# EAGLE design atariportable (EAGLE 9.4.2)
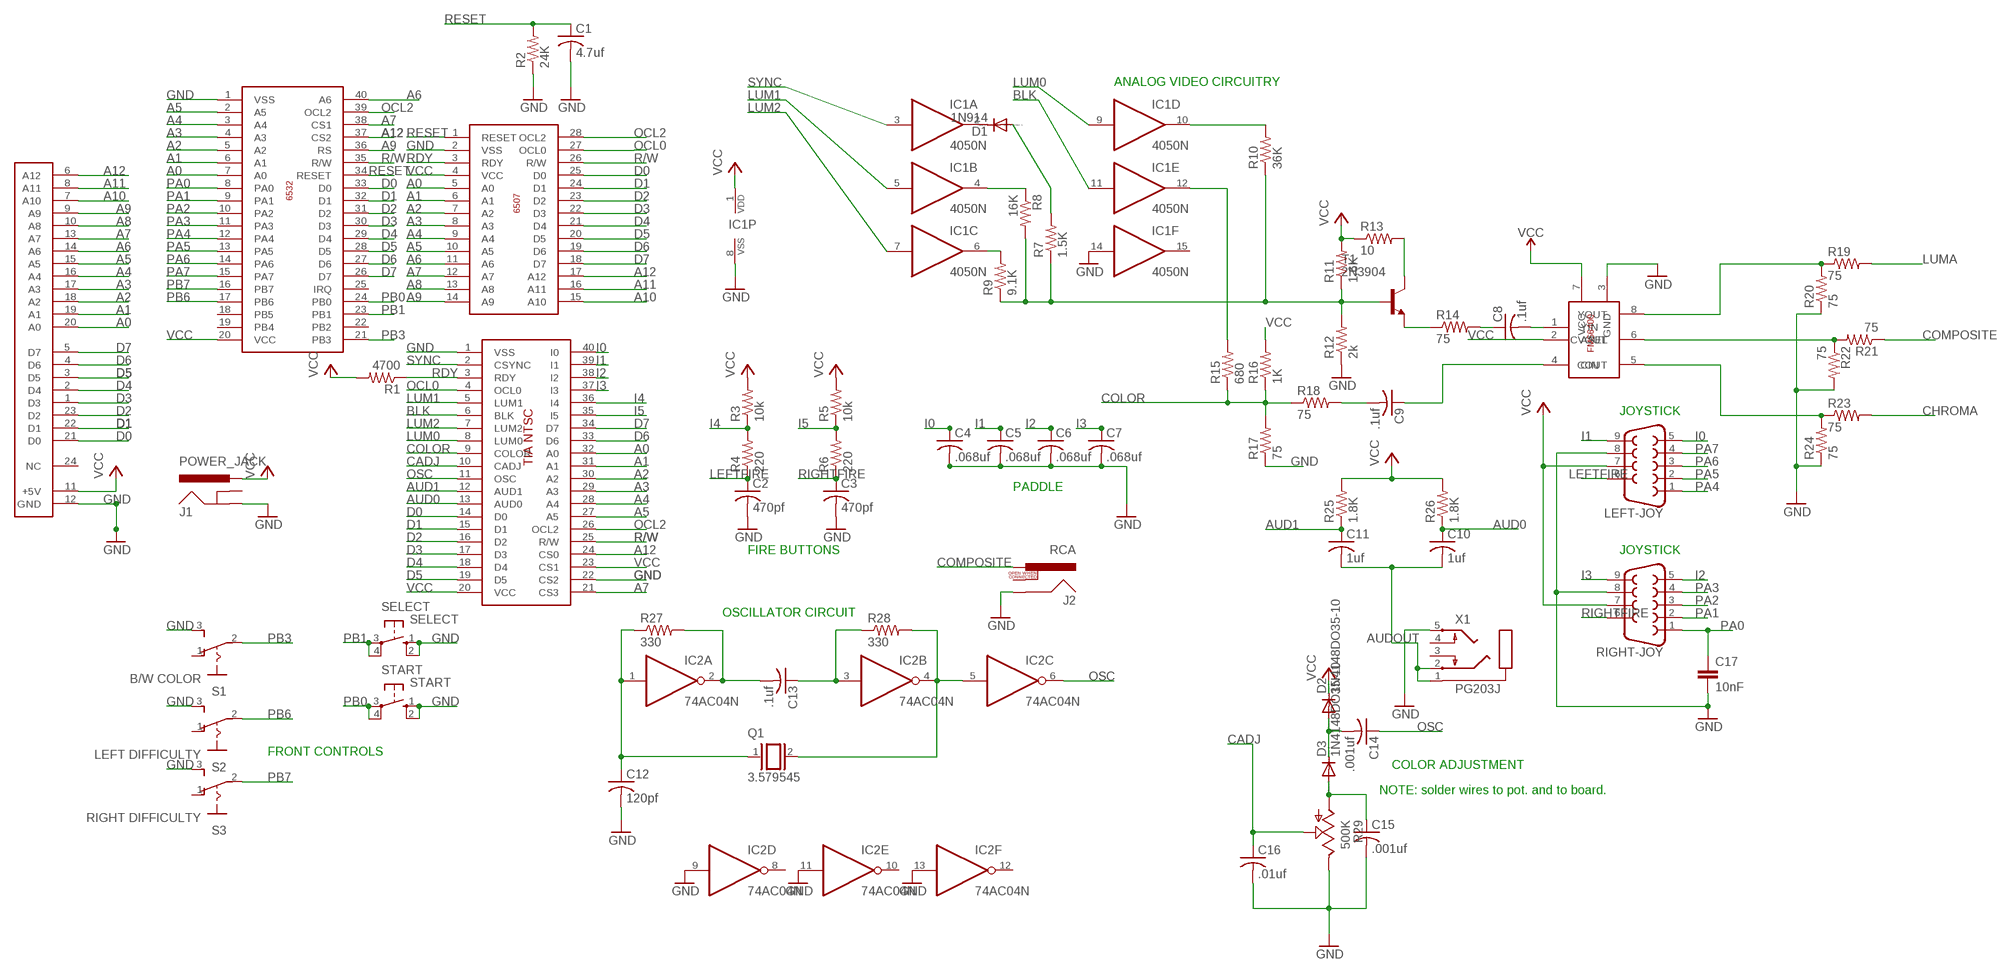
[diagram p0: schematic, sheet 1]

## Parts
6507  6507  [DIP28]
6532  6532  [DIP40]
C1  4.7uf  C-US025-030X050  [C025-030X050]
C2  470pf  C-US025-050X050  [C025-050X050]
C3  470pf  C-US025-050X050  [C025-050X050]
C4  .068uf  C-US025-024X044  [C025-024X044]
C5  .068uf  C-US025-024X044  [C025-024X044]
C6  .068uf  C-US025-024X044  [C025-024X044]
C7  .068uf  C-US025-024X044  [C025-024X044]
C8  .1uf  C-US025-025X050  [C025-025X050]
C9  .1uf  C-US025-025X050  [C025-025X050]
C10  1uf  C-US025-050X050  [C025-050X050]
C11  1uf  C-US025-050X050  [C025-050X050]
C12  120pf  C-US075-042X103  [C075-042X103]
C13  .1uf  C-US050-050X075  [C050-050X075]
C14  .001uf  C-US025-050X050  [C025-050X050]
C15  .001uf  C-US025-050X050  [C025-050X050]
C16  .01uf  C-US050-055X075  [C050-055X075]
C17  10nF  C2,5-3  [C2.5-3]
CONN1  24POSCECARDEDGE  [24POSEDGECARD]
D1  1N914  DIODE-DO35-10  [DO35-10]
D2  1N4148DO35-10  [DO35-10]
D3  1N4148DO35-10  [DO35-10]
IC1  4050N  [DIL16]
IC2  74AC04N  [DIL14]
J1  POWER_JACK  [POWER_JACK_PTH]
J2  RCA  [RCA]
LEFT-JOY  DB9MALE  [DB9_MALE]
Q1  3.579545  XTAL  [Q]
R1  4700  R-US_0207/10  [0207/10]
R2  24K  R-US_0207/10  [0207/10]
R3  10k  R-US_0207/10  [0207/10]
R4  220  R-US_0207/10  [0207/10]
R5  10k  R-US_0207/10  [0207/10]
R6  220  R-US_0207/10  [0207/10]
R7  1.5K  R-US_0207/10  [0207/10]
R8  16K  R-US_0207/10  [0207/10]
R9  9.1K  R-US_0207/10  [0207/10]
R10  36K  R-US_0207/10  [0207/10]
R11  1.6K  R-US_0207/10  [0207/10]
R12  2k  R-US_0207/10  [0207/10]
R13  10  R-US_0207/10  [0207/10]
R14  75  R-US_0207/10  [0207/10]
R15  680  R-US_0207/10  [0207/10]
R16  1K  R-US_0207/10  [0207/10]
R17  75  R-US_0207/10  [0207/10]
R18  75  R-US_0207/10  [0207/10]
R19  75  R-US_0207/10  [0207/10]
R20  75  R-US_0207/10  [0207/10]
R21  75  R-US_0207/10  [0207/10]
R22  75  R-US_0207/10  [0207/10]
R23  75  R-US_0207/10  [0207/10]
R24  75  R-US_0207/10  [0207/10]
R25  1.8K  R-US_0207/10  [0207/10]
R26  1.8K  R-US_0207/10  [0207/10]
R27  330  R-US_0207/10  [0207/10]
R28  330  R-US_0207/10  [0207/10]
R29  500K  TRIM_US-CA6V  [CA6V]
RIGHT-JOY  DB9MALE  [DB9_MALE]
S1  B/W COLOR  M251  [M251]
S2  LEFT DIFFICULTY  M251  [M251]
S3  RIGHT DIFFICULTY  M251  [M251]
SELECT  SELECT  10-XX  [B3F-10XX]
START  START  10-XX  [B3F-10XX]
T1  2N3904  [TO92]
TIA  TIA  [DIP40]
U$4  FMS6400  [SOIC8]
X1  PG203J  [PG203J]

## Nets
A0: 6507.5(A0) 6532.7(A0) CONN1.20(A0) TIA.32(A0)
A1: 6507.6(A1) 6532.6(A1) CONN1.19(A1) TIA.31(A1)
A2: 6507.7(A2) 6532.5(A2) CONN1.18(A2) TIA.30(A2)
A3: 6507.8(A3) 6532.4(A3) CONN1.17(A3) TIA.29(A3)
A4: 6507.9(A4) 6532.3(A4) CONN1.16(A4) TIA.28(A4)
A5: 6507.10(A5) 6532.2(A5) CONN1.15(A5) TIA.27(A5)
A6: 6507.11(A6) 6532.40(A6) CONN1.14(A6)
A7: 6507.12(A7) 6532.38(CS1) CONN1.13(A7) TIA.21(CS3)
A8: 6507.13(A8) CONN1.10(A8)
A9: 6507.14(A9) 6532.36(RS) CONN1.9(A9)
A10: 6507.15(A10) CONN1.7(A10)
A11: 6507.16(A11) CONN1.8(A11)
A12: 6507.17(A12) 6532.37(CS2) CONN1.6(A12) TIA.24(CS0)
AUD0: C10.1 R26.1 TIA.13(AUD0)
AUD1: C11.1 R25.1 TIA.12(AUD1)
AUDOUT: C10.2 C11.2 X1.1 X1.2
BLK: IC1.11(E:I) TIA.6(BLK)
CADJ: C16.1 R29.S TIA.10(CADJ)
CHROMA: R23.2
COLOR: R15.1 R16.1 R17.2 R18.1 TIA.9(COLOR)
COMPOSITE: J2.PIN R21.1
D0: 6507.25(D0) 6532.33(D0) CONN1.21(D0) TIA.14(D0)
D1: 6507.24(D1) 6532.32(D1) CONN1.22(D1) TIA.15(D1)
D2: 6507.23(D2) 6532.31(D2) CONN1.23(D2) TIA.16(D2)
D3: 6507.22(D3) 6532.30(D3) CONN1.1(D3) TIA.17(D3)
D4: 6507.21(D4) 6532.29(D4) CONN1.2(D4) TIA.18(D4)
D5: 6507.20(D5) 6532.28(D5) CONN1.3(D5) TIA.19(D5)
D6: 6507.19(D6) 6532.27(D6) CONN1.4(D6) TIA.33(D6)
D7: 6507.18(D7) 6532.26(D7) CONN1.5(D7) TIA.34(D7)
GND: 6507.2(VSS) 6532.1(VSS) C1.2 C2.2 C3.2 C4.2 C5.2 C6.2 C7.2 C12.2 C15.2 C16.2 C17.2 CONN1.12(GND) IC1.8(P:VSS) IC1.14(F:I) IC2.9(D:I) IC2.11(E:I) IC2.13(F:I) J1.GND J2.SHELL LEFT-JOY.8 R2.1 R12.1 R17.1 R20.1 R22.2 R24.1 R29.E RIGHT-JOY.8 S1.3(S) S2.3(S) S3.3(S) SELECT.1(S) SELECT.2(S1) START.1(S) START.2(S1) TIA.1(VSS) TIA.22(CS2) U$4.3(GND) X1.5
I0: C4.1 LEFT-JOY.5 TIA.40(I0)
I1: C5.1 LEFT-JOY.9 TIA.39(I1)
I2: C6.1 RIGHT-JOY.5 TIA.38(I2)
I3: C7.1 RIGHT-JOY.9 TIA.37(I3)
I4: R3.1 R4.2 TIA.36(I4)
I5: R5.1 R6.2 TIA.35(I5)
LEFTFIRE: C2.1 LEFT-JOY.6 R4.1
LUM0: IC1.9(D:I) TIA.8(LUM0)
LUM1: IC1.5(B:I) TIA.5(LUM1)
LUM2: IC1.7(C:I) TIA.7(LUM2)
LUMA: R19.2
N$1: D1.C IC1.2(A:O)
N$2: C8.2 U$4.1(YIN)
N$3: D1.A R7.2
N$4: IC1.4(B:O) R8.1
N$5: IC1.6(C:O) R9.2
N$6: R7.1 R8.2 R9.1 R10.1 R11.1 R12.2 T1.2(B)
N$7: IC1.10(D:O) R10.2
N$8: R13.2 T1.1(C)
N$9: R14.1 T1.3(E)
N$10: C8.1 R14.2
N$12: IC1.12(E:O) R15.2
N$13: C9.1 U$4.4(CIN)
N$14: C9.2 R18.2
N$15: R19.1 R20.2 U$4.8(YOUT)
N$16: R21.2 R22.1 U$4.6(CVOUT)
N$17: R23.1 R24.2 U$4.5(COUT)
N$18: C12.1 IC2.1(A:I) Q1.1 R27.1
N$19: C13.2 IC2.2(A:O) R27.2
N$20: C13.1 IC2.3(B:I) R28.1
N$21: IC2.4(B:O) IC2.5(C:I) Q1.2 R28.2
N$22: C14.2 D2.A D3.C
N$23: C15.1 D3.A R29.A
OCL0: 6507.27(OCL0) TIA.4(OCL0)
OCL2: 6507.28(OCL2) 6532.39(OCL2) TIA.26(OCL2)
OSC: C14.1 IC2.6(C:O) TIA.11(OSC)
PA0: 6532.8(PA0) C17.1 RIGHT-JOY.1
PA1: 6532.9(PA1) RIGHT-JOY.2
PA2: 6532.10(PA2) RIGHT-JOY.3
PA3: 6532.11(PA3) RIGHT-JOY.4
PA4: 6532.12(PA4) LEFT-JOY.1
PA5: 6532.13(PA5) LEFT-JOY.2
PA6: 6532.14(PA6) LEFT-JOY.3
PA7: 6532.15(PA7) LEFT-JOY.4
PB0: 6532.24(PB0) START.3(P) START.4(P1)
PB1: 6532.23(PB1) SELECT.3(P) SELECT.4(P1)
PB3: 6532.21(PB3) S1.2(P)
PB6: 6532.17(PB6) S2.2(P)
PB7: 6532.16(PB7) S3.2(P)
R/W: 6507.26(R/W) 6532.35(R/W) TIA.25(R/W)
RDY: 6507.3(RDY) R1.1 TIA.3(RDY)
RESET: 6507.1(RESET) 6532.34(RESET) C1.1 R2.2
RIGHTFIRE: C3.1 R6.1 RIGHT-JOY.6
SYNC: IC1.3(A:I) TIA.2(CSYNC)
VCC: 6507.4(VCC) 6532.20(VCC) CONN1.11(+5V) D2.C IC1.1(P:VDD) J1.PWR LEFT-JOY.7 R1.2 R3.2 R5.2 R11.2 R13.1 R16.2 R25.2 R26.2 RIGHT-JOY.7 TIA.20(VCC) TIA.23(CS1) U$4.2(ASEL) U$4.7(VCC)
Unconnected: 6532.18(PB5) 6532.19(PB4) 6532.22(PB2) 6532.25(IRQ) CONN1.24(NC) IC1.15(F:O) IC2.8(D:O) IC2.10(E:O) IC2.12(F:O) J1.GNDBREAK J2.SWITCH S1.1(O) S2.1(O) S3.1(O) X1.3 X1.4

## Notes on the sheet
- ANALOG VIDEO CIRCUITRY
- JOYSTICK
- PADDLE
- FIRE BUTTONS | JOYSTICK
- OSCILLATOR CIRCUIT
- FRONT CONTROLS | COLOR ADJUSTMENT
- NOTE: solder wires to pot. and to board.

## Power pins joined to a net without a drawn wire
GND: IC2.7(P:GND)
VCC: IC2.14(P:VCC)

## Library data of the parts
6507 = Atari2600-2:6507
6532 = Atari2600-2:6532
C1 C4-C9 = resistor:C-US: CAPACITOR, American symbol
C2 C3 C10-C16 = rcl:C-US: CAPACITOR, American symbol
C17 = capacitor-wima:C: CAPACITOR naming: grid - package width
CONN1 = 2600:24POSCE
D1 = diode:DIODE-: DIODE
D2 D3 = diode:1N4148: DIODE high speed (Philips)
IC1 = 40xx:4050: Hex non-inverting BUFFER
IC2 = 74xx-eu:74*04: Hex INVERTER
J1 = SparkFun-Connectors:POWER_JACK: Power Jack Connector This is the standard 5.5mm barrel jack for power. The PTH is the most common, proven, reliable, footprint. The Slot footprint only works if the mill layer is transmitted to the PCB fab house so be warned. Here are the connectors we sell at SparkFun: DC Barrel Power Jack/Connector <https://www.sparkfun.com/products/119> (PRT-00119) DC Barrel Power Jack/Connector (SMD) <https://www.sparkfun.com/products/12748> (PRT-12748) DC Barrel Jack Adapter - Breadboard Compatible <https://www.sparkfun.com/products/10811> (PRT-10811) It is used on this SparkFun product (and many, many others): SparkFun RedBoard - Programmed with Arduino <https://www.sparkfun.com/products/12757> (DEV-12757) Also, if you need a mating power supply or connector, please check these out: Wall Adapter Power Supply - 9VDC 650mA <https://www.sparkfun.com/products/298> (TOL-00298) DC Barrel Jack Adapter - Male <https://www.sparkfun.com/products/10287> (PRT-10287); PROD_ID: CONN-08197
J2 = SparkFun-Connectors:RCA: RCA Jack connector This is a right angle RCA jack connecotr. Commonly used for video or audio. Here is the connector we sell at SparkFun: RCA Jack <https://www.sparkfun.com/products/8631> (PRT-08631) Datasheet <http://www.sparkfun.com/datasheets/Prototyping/Connectors/RCA-Jack.pdf> It is not used on any active designs, however it was used on a couple retired products: RCA Jack Breakout [RETIRED] <https://www.sparkfun.com/products/8826> (PRT-08826) SparkFun On Screen Display Breakout - MAX7456 [RETIRED] <https://www.sparkfun.com/products/9168> (BOB-09168) You may also be interested in a cable: RCA Video Cable - 6' <https://www.sparkfun.com/products/11573> (CAB-11573); PROD_ID: CONN-09081; SF_ID: PRT-08631
LEFT-JOY RIGHT-JOY = SparkFun-Connectors:DB9: DB9 Connector Standard DB9 (D-Sub 9) serial connector. Can be used for CAN bus as well as RS485 and RS232. Footprint production proven. Here is the female version connector we sell at SparkFun: 9 Pin Female Serial Connector - PCB Mount <https://www.sparkfun.com/products/429> (PRT-00429) This connector has been used on the following SparkFun products: SparkFun RS232 Shifter - SMD <https://www.sparkfun.com/products/449> (PRT-00449) SparkFun RS232 Shifter SMD (No DB9) <https://www.sparkfun.com/products/8780> (PRT-08780); PROD_ID: CONN-09904
Q1 = special:XTAL: CRYSTAL
R1 R2 = resistor:R-US_: RESISTOR, American symbol
R3-R28 = rcl:R-US_: RESISTOR, American symbol
R29 = pot:TRIM_US-: POTENTIOMETER
S1-S3 = switch:M251: SLIDING SWITCH Mors, distributor Buerklin, 11G702
SELECT START = switch-omron:10-XX: OMRON SWITCH; MPN: B3F-1000; OC_FARNELL: 176432; OC_NEWARK: 36M3542
T1 = transistor:2N3904: NPN TRANSISTOR
TIA = Atari2600-2:TIA: The Television Interface Adapter used on the Atari 2600
U$4 = Atari2600-2:FMS6400
X1 = con-hirschmann:PG203J: MIC/HEADPHONE JACK KS-S stereo microphone/headphone jack PG203JN (Schukat); OC_FARNELL: unknown; OC_NEWARK: unknown

## Board
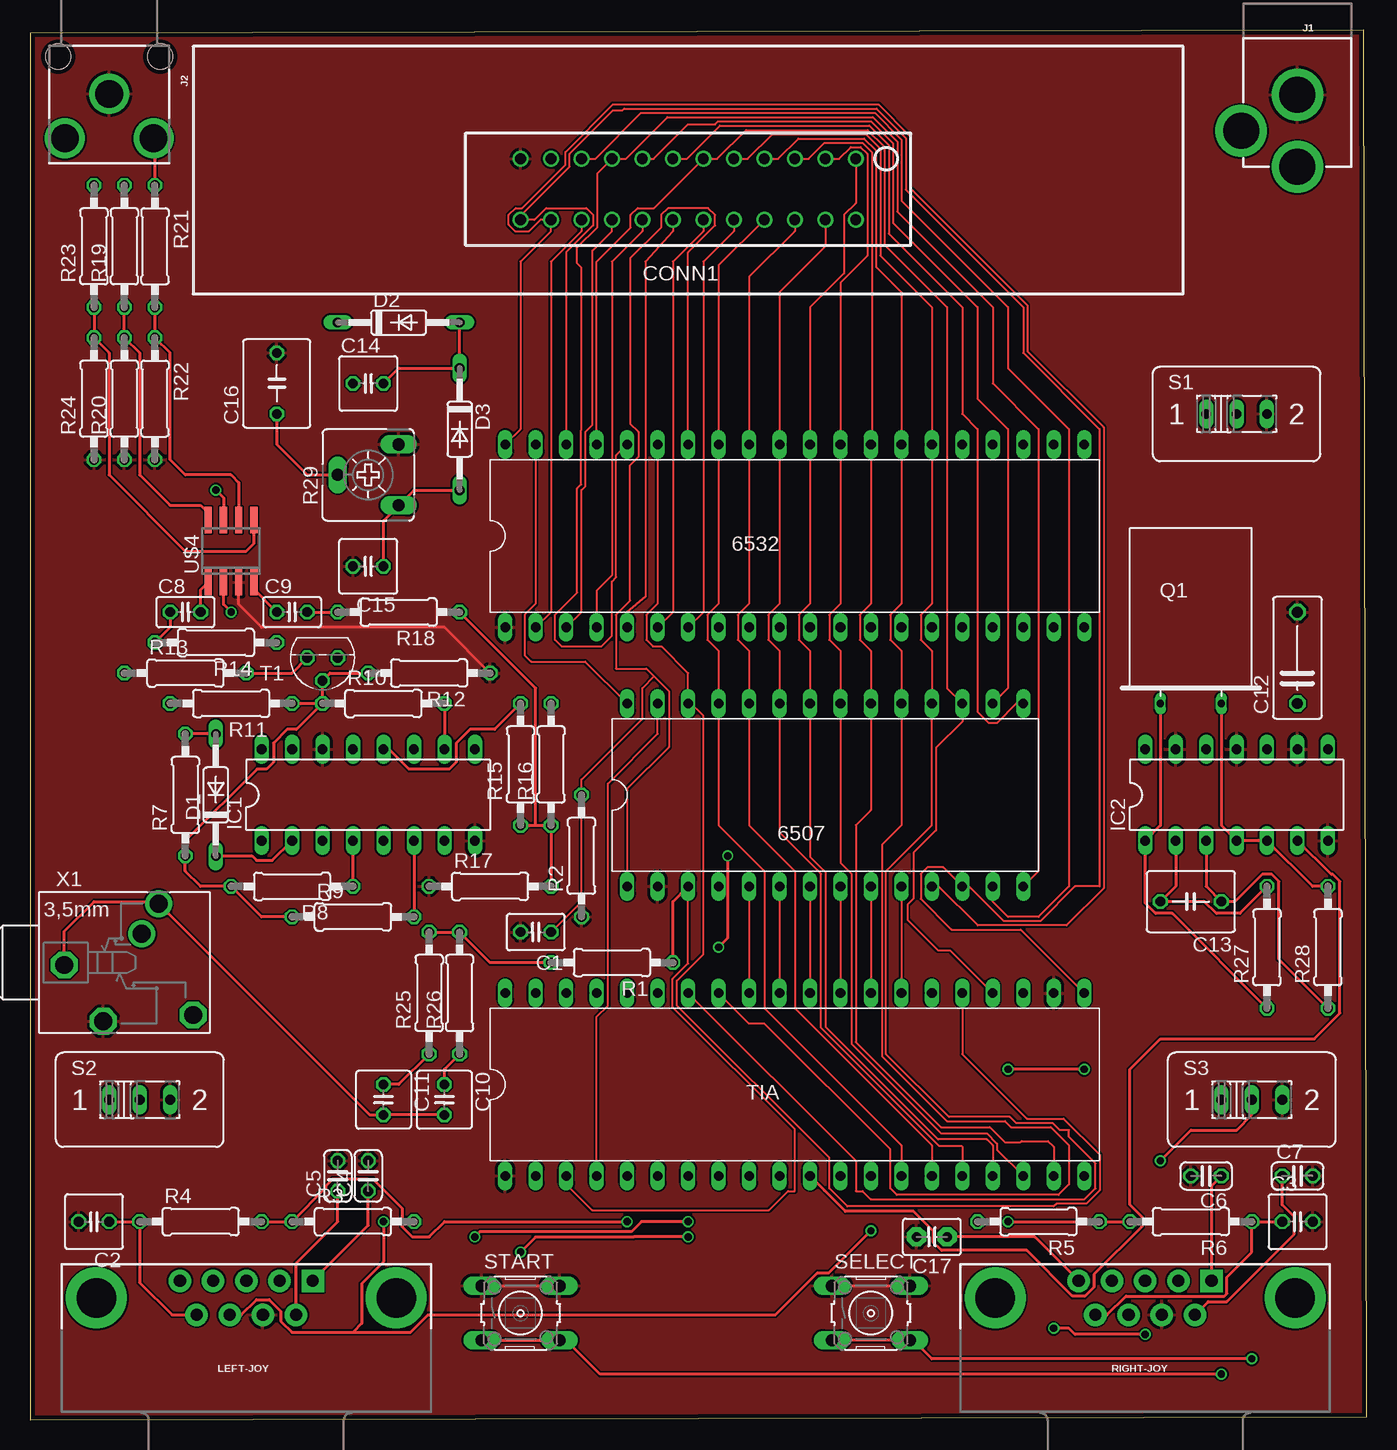
[diagram p1: board, top side]
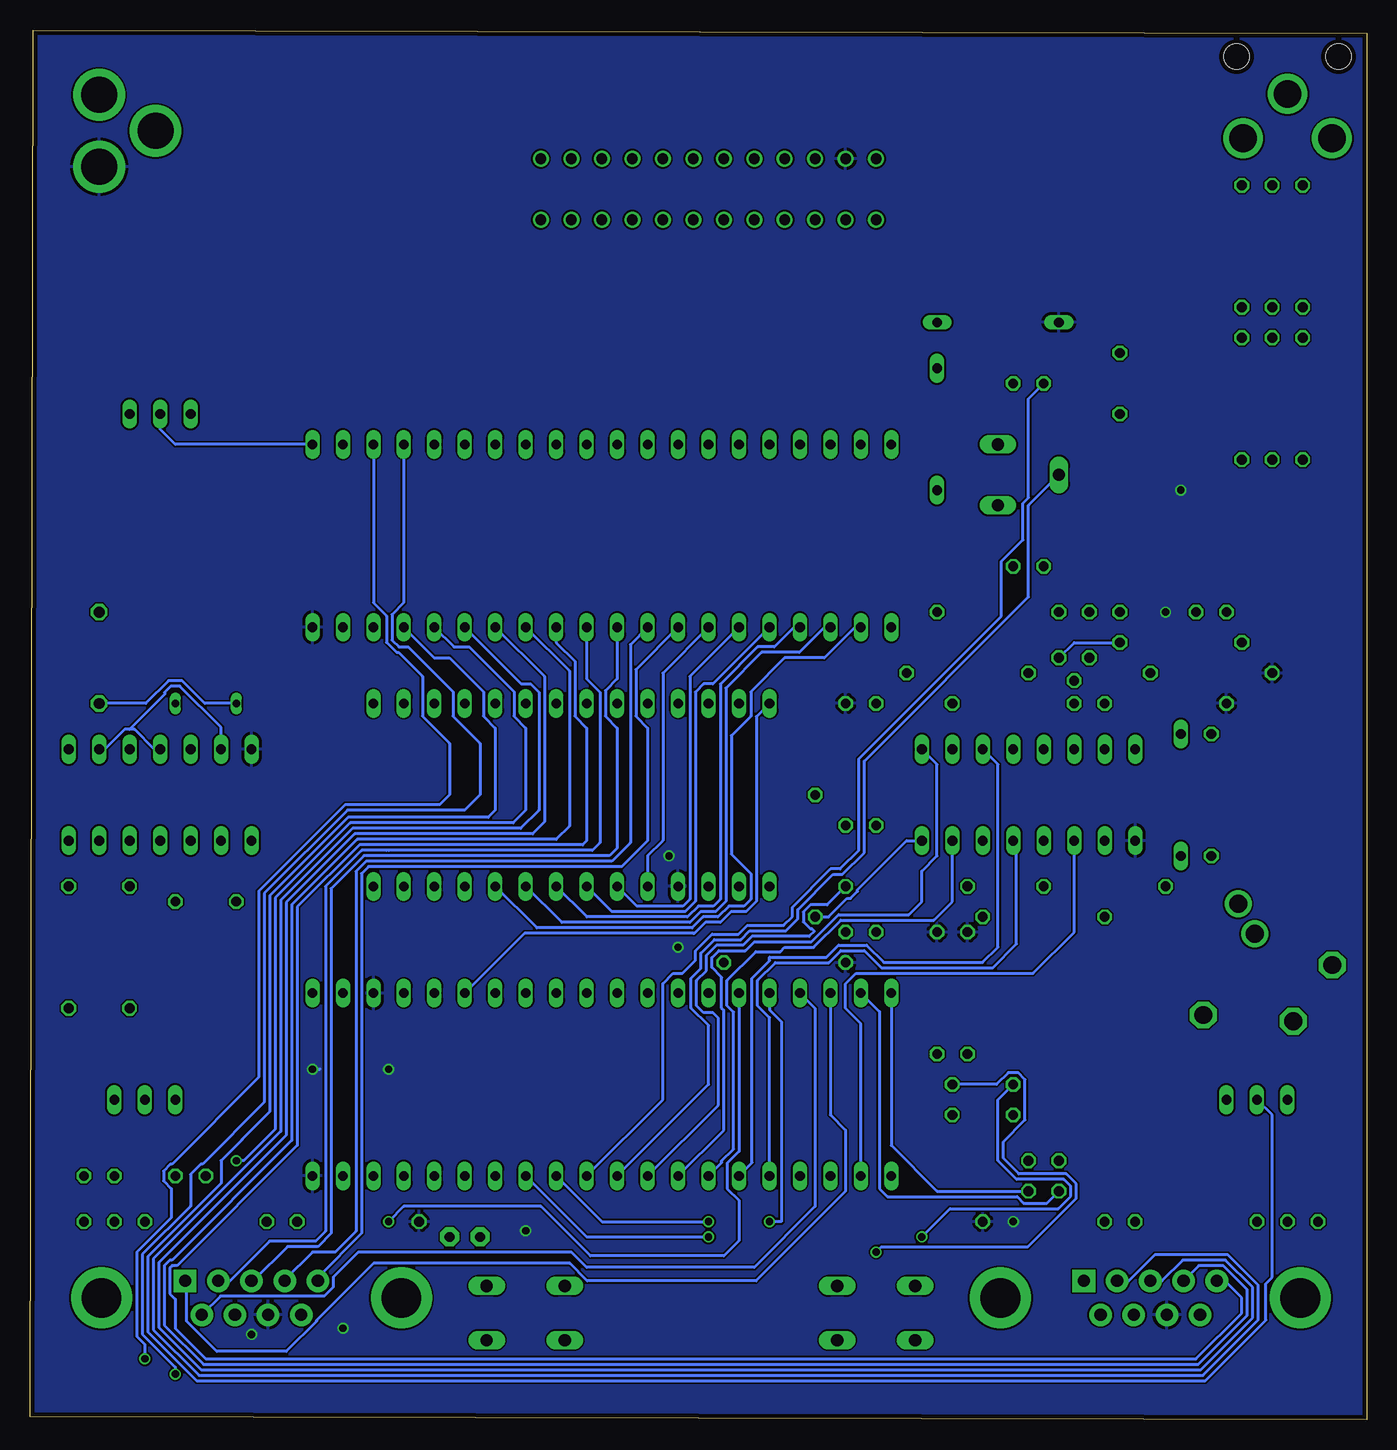
[diagram p2: board, bottom side, seen from below]

Size 111.43 x 115.81 mm. Coordinates in mm from the lower left corner, seen from the top.
Outline: 0,0 111.43,0.25 111.18,115.81 0,115.56 0,0
Copper layers (1*16): Top 0.035559375mm / dielectric 1.6mm / Bottom 0.035559375mm
Design rules "oshpark-2layer": minimum track width 6mil, minimum drill 10mil, track to track 6mil, track to pad 6mil, pad to pad 6mil, via to via 6mil, smd to smd 6mil, copper to edge 15mil, drill to drill 6mil, minimum pad ring 5mil, minimum via ring 5mil, stop-mask expansion 2.5mil, vias tented up to drill 0mil, thermal gap 10mil

### Footprints (pad centres in the part's own frame; a part is rotated, then mirrored left to right if it is on the bottom)
DIP28 = drill 0.8 long: 1 -7.62,12.7; 2 -7.62,10.16; 3 -7.62,7.62; 4 -7.62,5.08; 5 -7.62,2.54; 6 -7.62,0; 7 -7.62,-2.54; 8 -7.62,-5.08; 9 -7.62,-7.62; 10 -7.62,-10.16; 11 -7.62,-12.7; 12 -7.62,-15.24; 13 -7.62,-17.78; 14 -7.62,-20.32; 15 7.62,-20.32; 16 7.62,-17.78; 17 7.62,-15.24; 18 7.62,-12.7; 19 7.62,-10.16; 20 7.62,-7.62; 21 7.62,-5.08; 22 7.62,-2.54; 23 7.62,0; 24 7.62,2.54; 25 7.62,5.08; 26 7.62,7.62; 27 7.62,10.16; 28 7.62,12.7
DIP40 = drill 0.8 long: 1 -10.16,12.7; 2 -10.16,10.16; 3 -10.16,7.62; 4 -10.16,5.08; 5 -10.16,2.54; 6 -10.16,0; 7 -10.16,-2.54; 8 -10.16,-5.08; 9 -10.16,-7.62; 10 -10.16,-10.16; 11 -10.16,-12.7; 12 -10.16,-15.24; 13 -10.16,-17.78; 14 -10.16,-20.32; 15 -10.16,-22.86; 16 -10.16,-25.4; 17 -10.16,-27.94; 18 -10.16,-30.48; 19 -10.16,-33.02; 20 -10.16,-35.56; 21 5.08,-35.56; 22 5.08,-33.02; 23 5.08,-30.48; 24 5.08,-27.94; 25 5.08,-25.4; 26 5.08,-22.86; 27 5.08,-20.32; 28 5.08,-17.78; 29 5.08,-15.24; 30 5.08,-12.7; 31 5.08,-10.16; 32 5.08,-7.62; 33 5.08,-5.08; 34 5.08,-2.54; 35 5.08,0; 36 5.08,2.54; 37 5.08,5.08; 38 5.08,7.62; 39 5.08,10.16; 40 5.08,12.7
C025-030X050 = drill 0.813 octagon: 1 -1.27,0; 2 1.27,0
C025-050X050 = drill 0.813 octagon: 1 -1.27,0; 2 1.27,0
C025-024X044 = drill 0.813 octagon: 1 -1.27,0; 2 1.27,0
C025-025X050 = drill 0.813 octagon: 1 -1.27,0; 2 1.27,0
C075-042X103 = drill 0.914 octagon: 1 -3.81,0; 2 3.81,0
C050-050X075 = drill 0.813 octagon: 1 -2.54,0; 2 2.54,0
C050-055X075 = drill 0.813 octagon: 1 -2.54,0; 2 2.54,0
C2.5-3 = drill 0.813 pad 1.6 octagon: 1 -1.27,0; 2 1.27,0
24POSEDGECARD = drill 0.889: 1 -13.97,-0.94; 2 -11.43,-0.94; 3 -8.89,-0.94; 4 -6.35,-0.94; 5 -3.81,-0.94; 6 -1.27,-0.94; 7 1.27,-0.94; 8 3.81,-0.94; 9 6.35,-0.94; 10 8.89,-0.94; 11 11.43,-0.94; 12 13.97,-0.94; 13 13.97,4.14; 14 11.43,4.14; 15 8.89,4.14; 16 6.35,4.14; 17 3.81,4.14; 18 1.27,4.14; 19 -1.27,4.14; 20 -3.81,4.14; 21 -6.35,4.14; 22 -8.89,4.14; 23 -11.43,4.14; 24 -13.97,4.14
DO35-10 = drill 0.813 long: A 5.08,0; C -5.08,0
DIL16 = drill 0.813 long: 1 -8.89,-3.81; 2 -6.35,-3.81; 3 -3.81,-3.81; 4 -1.27,-3.81; 5 1.27,-3.81; 6 3.81,-3.81; 7 6.35,-3.81; 8 8.89,-3.81; 9 8.89,3.81; 10 6.35,3.81; 11 3.81,3.81; 12 1.27,3.81; 13 -1.27,3.81; 14 -3.81,3.81; 15 -6.35,3.81; 16 -8.89,3.81
DIL14 = drill 0.813 long: 1 -7.62,-3.81; 2 -5.08,-3.81; 3 -2.54,-3.81; 4 0,-3.81; 5 2.54,-3.81; 6 5.08,-3.81; 7 7.62,-3.81; 8 7.62,3.81; 9 5.08,3.81; 10 2.54,3.81; 11 0,3.81; 12 -2.54,3.81; 13 -5.08,3.81; 14 -7.62,3.81
POWER_JACK_PTH = drill 2.997 pad 4.318: GND 0,7.7; GNDBREAK 4.7,10.7; PWR 0,13.7
RCA = drill 2.3: PIN 3.7,3.7; SHELL 0,0; SWITCH 3.7,-3.7 | hole 2.1: -3.1,4.25; -3.1,-4.25
DB9_MALE = drill 1.016 pad 1.88: 1 5.54,-1.42; 2 2.77,-1.42; 3 0,-1.42; 4 -2.77,-1.42; 6 4.15,1.42; 7 1.38,1.42; 8 -1.38,1.42; 9 -4.15,1.42 | drill 1.016 pad 1.88 square: 5 -5.54,-1.42 | drill 3.302 pad 5.08: G1 -12.5,0; G2 12.5,0
Q = drill 0.61 long: 1 -2.54,-7.62; 2 2.54,-7.62
0207/10 = drill 0.813 octagon: 1 -5.08,0; 2 5.08,0
CA6V = drill 1.016 long: A -2.54,-2.54; E 2.54,-2.54; S 0,2.54
M251 = drill 0.813 long: 1 -2.54,0; 2 0,0; 3 2.54,0
B3F-10XX = drill 1.016 long: 1 -3.251,2.261; 2 3.251,2.261; 3 -3.251,-2.261; 4 3.251,-2.261
TO92 = drill 0.813 octagon: 1 1.27,0; 2 0,1.905; 3 -1.27,0
SOIC8 = smd 0.6 x 2.2: 1 -1.905,-2.6; 2 -0.635,-2.6; 3 0.635,-2.6; 4 1.905,-2.6; 5 1.905,2.6; 6 0.635,2.6; 7 -0.635,2.6; 8 -1.905,2.6
PG203J = drill 1.499 octagon: 1 -5.004,-0.203; 4 5.74,-4.369; 5 -1.753,-4.902 | drill 1.499: 2 2.845,4.902; 3 1.448,2.388

### Placement (x,y rotation side)
6507  62.48,52.07 90 top
6532  52.32,76.2 90 top
C1  42.16,40.64 180 top
C2  5.33,16.51 180 top
C3  105.66,16.51 0 top
C4  28.19,20.32 90 top
C5  25.65,20.32 90 top
C6  98.04,20.32 180 top
C7  105.66,20.32 0 top
C8  12.95,67.31 0 top
C9  21.84,67.31 0 top
C10  34.54,26.67 270 top
C11  29.46,26.67 270 top
C12  105.66,63.5 90 top
C13  96.77,43.18 180 top
C14  28.19,86.36 0 top
C15  28.19,71.12 180 top
C16  20.57,86.36 90 top
C17  75.18,15.24 180 top
CONN1  54.86,104.14 180 top
D1  15.49,52.07 90 top
D2  30.73,91.44 0 top
D3  35.81,82.55 270 top
IC1  28.19,52.07 0 top
IC2  100.58,52.07 0 top
J1  105.66,118.11 180 top
J2  6.6,110.49 270 top
LEFT-JOY  18.03,10.16 180 top
Q1  96.77,67.31 0 top
R1  48.51,38.1 180 top
R2  45.97,46.99 90 top
R3  26.92,16.51 0 top
R4  14.22,16.51 0 top
R5  84.07,16.51 180 top
R6  96.77,16.51 180 top
R7  12.95,52.07 90 top
R8  21.84,44.45 180 top
R9  26.92,41.91 0 top
R10  29.46,59.69 0 top
R11  16.76,59.69 180 top
R12  33.27,62.23 180 top
R13  12.95,62.23 0 top
R14  15.49,64.77 180 top
R15  40.89,54.61 90 top
R16  43.43,54.61 90 top
R17  38.35,44.45 0 top
R18  30.73,67.31 180 top
R19  7.87,97.79 90 top
R20  7.87,85.09 90 top
R21  10.41,97.79 270 top
R22  10.41,85.09 270 top
R23  5.33,97.79 90 top
R24  5.33,85.09 90 top
R25  33.27,35.56 90 top
R26  35.81,35.56 90 top
R27  103.12,39.37 90 top
R28  108.2,39.37 90 top
R29  28.19,78.74 90 top
RIGHT-JOY  92.96,10.16 180 top
S1  100.58,83.82 0 top
S2  9.14,26.67 0 top
S3  101.85,26.67 0 top
SELECT  70.1,8.89 0 top
START  40.89,8.89 0 top
T1  24.38,63.5 180 top
TIA  52.32,30.48 90 top
U$4  16.76,72.39 0 top
X1  7.87,38.1 0 top

### Tracks (layer width: path | path; a pad name or v marks a point on that pad's centre or on a via)
A0
  Top 0.152: CONN1.20 58.67,99.06 56.13,96.52 56.13,67.31 6532.7 | 6507.5 TIA.32
  Bottom 0.254: 6532.7 58.67,62.23 58.67,48.26 59.94,46.99 6507.5
A1
  Top 0.152: CONN1.19 56.13,99.06 53.59,96.52 53.59,67.31 6532.6 | 6507.6 TIA.31
  Bottom 0.254: 6532.6 56.42,61.94 56.42,43.39 57,42.81 60.85,42.81 6507.6
A2
  Top 0.152: CONN1.18 53.59,99.06 51.31,96.52 51.31,68.58 49.78,67.31 6532.5 | 6507.7 TIA.30
  Bottom 0.254: 6532.5 54.5,61.33 55.27,61.33 55.96,60.64 55.96,43.2 56.81,42.35 62.93,42.35 6507.7
A3
  Top 0.152: CONN1.17 51.05,99.06 48.51,96.52 48.51,70.36 47.24,69.09 6532.4 | 6507.8 TIA.29
  Bottom 0.254: 6532.4 47.74,66.04 49.38,64.4 50.78,64.4 53.88,61.3 53.88,43.39 54.46,42.81 55.7,42.81 56.62,41.9 65.01,41.9 6507.8
A4
  Top 0.152: CONN1.16 48.51,99.06 46.89,97.43 46.89,82.9 46.31,82.32 46.31,77.81 45.97,77.47 45.97,67.31 6532.3 | 6507.9 TIA.28
  Bottom 0.254: 6532.3 45.2,66.04 47.29,63.95 50.44,63.95 53.42,60.96 53.42,43.2 54.27,42.35 55.51,42.35 56.43,41.44 67.09,41.44 6507.9
A5
  Top 0.152: CONN1.15 45.97,99.06 43.43,96.52 43.43,67.31 6532.2 | 6507.10 TIA.27
  Bottom 0.254: 6532.2 42.66,66.04 45.21,63.49 48.51,63.49 51.34,60.66 51.34,58.63 52.96,57 52.96,47.14 51.34,45.51 51.34,43.39 51.92,42.81 53.16,42.81 54.08,41.9 55.32,41.9 56.24,40.98 69.18,40.98 6507.10
A6
  Top 0.152: 6532.40 40.89,82.55 40.89,96.52 43.43,99.06 CONN1.14 42.55,100 41.58,99.02 40.49,99.02 39.92,99.59 39.92,100.41 40.49,100.98 41.04,100.98 44.64,104.58 44.64,105.63 48.62,109.61 70.71,109.61 73.37,106.96 73.37,102.65 83.16,92.86 83.16,89.05 89.51,82.7 89.51,44.3 86.41,41.2 79,41.2 75.75,44.45 6507.11
A7
  Top 0.152: 6532.38 44.7,97.29 46.95,99.53 46.95,100.41 46.38,100.98 43.03,100.98 42.05,100 CONN1.13 40.89,100.33 45,104.43 45,105.48 48.62,109.11 49.39,109.11 49.54,109.26 70.56,109.26 73.01,106.81 73.01,102.5 82.8,92.71 82.8,88.9 89.15,82.55 89.15,44.45 87.12,44.45 84.22,41.55 81.19,41.55 78.29,44.45 6507.12 76.14,46.04 74.8,46.04 74.25,45.49 74.25,43.41 76.82,40.84 82.6,40.84 TIA.21
A8
  Top 0.152: CONN1.10 47.13,105.08 50.95,108.9 70.42,108.9 72.66,106.66 72.66,101.59 81.53,92.71 81.53,87.63 86.61,82.55 86.61,44.45 84.07,41.91 81.53,41.91 80.26,43.18 6507.13
A9
  Top 0.152: 6507.14 84.07,45.72 84.07,82.55 80.26,86.36 80.26,92.71 72.3,100.67 72.3,106.52 70.27,108.55 53.14,108.55 49.67,105.08 CONN1.9 47.31,103.87 47.31,99.39 45.62,97.7 45.62,96.37 45.97,96.02 45.97,82.49 45.95,82.47 45.95,77.95 45.62,77.62 45.62,68.93 43.77,67.08 43.77,65 44.32,64.45 47.63,64.45 48.51,65.34 48.51,69.86 48.87,70.21 48.87,80.37 6532.36
A10
  Top 0.152: CONN1.7 54.75,105.08 57.51,107.84 69.98,107.84 71.59,106.22 71.59,98.84 77.72,92.71 77.72,83.82 78.99,82.55 78.99,58.99 79.88,58.1 80.65,58.1 82.24,59.69 6507.15
A11
  Top 0.152: CONN1.8 51.99,105.08 54.86,107.95 57.12,107.95 57.36,108.19 70.12,108.19 71.94,106.37 71.94,99.76 78.99,92.71 78.99,85.09 81.53,82.55 81.53,60.96 6507.16
A12
  Top 0.152: 6532.37 47.24,96.52 50.08,99.35 50.08,100.41 50.65,100.98 52.03,100.98 CONN1.6 57.29,105.08 59.69,107.48 69.83,107.48 71.23,106.07 71.23,97.93 76.45,92.71 76.45,60.96 6507.17 77.72,58.17 75.54,55.98 75.54,49.12 73.66,47.24 73.66,43.43 73.15,42.93 73.15,41.66 75.69,39.12 76.71,39.12 TIA.24
AUD0  (via drill 0.61)
  Top 0.254: C10.1 34.54,29.21 R26.1 | v54.86,15.24 50.35,15.24 50.32,15.21 42.14,15.21 v40.89,13.97
  Bottom 0.254: TIA.13 65.02,15.24 v54.86,15.24 | v40.89,13.97 40.46,14.4 28.25,14.4 24.21,18.45 24.21,19.65 25.05,20.5 29,20.5 30.28,21.78 30.28,23.19 28.47,24.99 28.47,28.35 29.05,28.93 29.87,28.93 30.87,27.94 C10.1
AUD1  (via drill 0.61)
  Top 0.254: R25.1 30.73,27.94 C11.1 | v54.86,16.51 50.97,16.51 50.13,15.67 37.52,15.67 v37.08,15.24
  Bottom 0.254: TIA.12 63.75,16.51 v54.86,16.51 | v37.08,15.24 34.72,17.6 25.7,17.6 24.66,18.64 24.66,19.46 25.24,20.04 29.18,20.04 30.73,21.59 30.73,26.67 C11.1
AUDOUT
  Top 0.254: C10.2 C11.2 28.32,25.4 X1.2 10.54,43.18 5.33,43.18 2.87,40.72 X1.1
BLK
  Bottom 0.254: IC1.11 30.73,54.61 30.73,39.39 32.02,38.11 40.26,38.11 41.7,39.55 44.03,39.55 45.02,38.56 49.78,38.56 49.78,38.25 51.22,36.81 51.22,21.42 TIA.6
CADJ
  Top 0.254: C16.1 20.57,81.28 23.11,78.74 R29.S
  Bottom 0.254: TIA.10 54.86,27.94 54.86,32.87 56.3,34.31 56.3,36.81 55.5,37.62 55.5,38.89 54.38,40 52.17,40 51.43,40.74 48.41,40.74 47.42,41.73 47.42,42.51 44.49,45.44 43.71,45.44 41.88,47.27 41.88,54.89 28.19,68.58 28.19,76.2 R29.S
COLOR
  Top 0.254: R15.1 42.16,49.53 | 42.16,49.53 R16.1 R17.2 | 42.16,49.53 42.16,60.96 R18.1
  Bottom 0.254: TIA.9 54.05,26.21 54.05,33.48 54.5,33.92 55.27,33.92 55.85,34.5 55.85,36.62 55.04,37.43 55.04,38.7 54.19,39.55 51.98,39.55 51.24,40.28 46.48,40.28 46.05,40.72 46.25,40.92 46.38,40.92 46.96,41.5 46.96,42.32 46.38,42.9 44.98,42.9 R17.2
COMPOSITE
  Top 0.254: J2.PIN 10.41,106.68 R21.1
D0
  Top 0.152: CONN1.21 57.4,96.19 6532.33 57.4,68.01 56.47,67.08 56.47,65 57.4,64.07 6507.25 57.4,49.53 61.21,45.72 61.21,34.29 72.64,22.86 TIA.14
D1
  Top 0.152: CONN1.22 63.75,99.06 59.94,95.25 6532.32 59.94,68.01 59.01,67.08 59.01,65 59.94,64.07 6507.24 59.94,49.53 61.21,48.26 63.75,45.72 63.75,34.29 75.18,22.86 TIA.15
D2
  Top 0.152: CONN1.23 66.29,97.79 62.48,93.98 6532.31 62.48,68.01 61.55,67.08 61.55,65 62.48,64.07 6507.23 62.48,48.96 65.96,45.49 65.96,32.66 75.81,22.81 77.67,22.81 77.72,22.76 TIA.16
D3
  Top 0.152: CONN1.1 68.83,101.38 67.86,100.41 67.86,95.54 65.02,92.71 6532.30 65.02,68.01 64.09,67.08 64.09,65 65.02,64.07 6507.22 65.02,46.93 66.31,45.64 66.31,32.75 75.69,23.37 79.76,23.37 80.26,22.86 TIA.17
D4
  Top 0.152: CONN1.2 67.45,105.08 68.43,106.06 69.24,106.06 69.81,105.48 69.81,97 67.56,94.75 6532.29 67.56,68.01 66.63,67.08 66.63,65 67.56,64.07 6507.21 67.56,46.42 68.5,45.49 68.5,31.33 75.95,23.88 79.75,23.88 80.62,23.01 80.62,22.5 TIA.18
D5
  Top 0.152: CONN1.3 64.91,105.08 66.25,106.41 69.39,106.41 70.17,105.63 70.17,81.34 6532.28 70.1,68.01 69.17,67.08 69.17,65 70.1,64.07 6507.20 70.1,50.8 68.85,49.55 68.85,31.48 75.95,24.38 80.01,24.38 81.28,23.11 82.55,23.11 82.66,23.22 84.86,23.22 85.34,22.74 TIA.19
D6
  Top 0.152: CONN1.4 62.37,105.08 64.06,106.77 69.53,106.77 70.52,105.78 70.52,96.1 72.64,93.98 6532.27 72.64,68.01 71.71,67.08 71.71,65 72.64,64.07 6507.19 72.64,49.53 71.04,47.92 71.04,30.31 76.45,24.89 81.27,24.89 81.78,24.38 85.09,24.38 86.61,22.86 86.61,19.62 85.73,18.73 72.26,18.73 71.71,19.28 71.71,21.46 | 71.71,21.46 | 71.71,21.46 71.71,22.52 61.21,33.02 59.94,33.02 TIA.33
D7
  Top 0.152: CONN1.5 59.83,105.08 61.88,107.12 69.68,107.12 70.88,105.93 70.88,97.02 75.18,92.71 6532.26 75.18,68.01 74.25,67.08 74.25,65 75.18,64.07 6507.18 75.18,49.53 71.39,45.74 71.37,45.72 71.37,30.48 76.61,25.25 81.69,25.25 82.2,24.74 85.24,24.74 85.85,24.13 86.61,24.13 86.61,23.56 88.82,21.36 88.82,19.28 87.91,18.38 70.07,18.38 69.4,19.05 68.83,19.05 68.83,21.59 TIA.34
GND
  Top 0.254: R12.1 34.54,66.04 19.3,66.04 17.4,67.95 U$4.3 | START.1 START.2 | SELECT.1 SELECT.2
  Bottom 0.254: R2.1 44.86,41.91 43.31,43.46 43.02,43.46 42.44,44.04 42.44,44.17 38.35,48.26 IC1.8 | 103.12,57.53 102.71,57.53 101.06,55.88 IC2.11 | 103.12,57.53 103.53,57.53 105.19,55.88 IC2.9 | IC2.13 95.5,57.7 98.95,61.14 99.68,61.14 100.2,60.62 100.2,60.45 103.12,57.53
  pour Top: 112.01,0 -2.29,0 -3.56,-1.27 -3.56,118.11 -4.83,119.38 117.09,119.38 118.36,118.11 118.36,6.35
I0
  Top 0.254: LEFT-JOY.5 28.19,16.2 C4.1
  Bottom 0.254: TIA.40 39.62,22.86 35.81,19.05 C4.1
I1
  Top 0.254: LEFT-JOY.9 22.18,13.04 25.65,16.51 C5.1
  Bottom 0.254: TIA.39 40.61,34 40.61,19.26 39.94,18.59 29.14,18.59 28.6,18.06 26.64,18.06 C5.1
I2
  Top 0.254: RIGHT-JOY.5 98.5,19.51 C6.1
  Bottom 0.254: TIA.38 44.7,25.4 43.43,24.13 43.43,19.05 50.9,11.58 64.98,11.58 66.43,13.03 82.8,13.03 87.54,8.29 87.54,8.21 90.07,5.69 95.86,5.69 98.38,8.21 98.38,11.46 RIGHT-JOY.5
I3
  Top 0.254: RIGHT-JOY.9 98.23,9.85 99.77,9.85 105.38,15.47 105.38,16.92 104.39,17.91 C7.1
  Bottom 0.254: TIA.37 45.97,34.29 45.97,17.78 51.05,12.7 65.02,12.7 66.29,13.97 84.07,13.97 86.15,11.89 86.15,11.05 86.9,10.31 95.54,10.31 RIGHT-JOY.9
I4  (via drill 0.61)
  Top 0.254: R4.2 R3.1 24.66,19.33 24.66,19.46 25.24,20.04 28.19,20.04 28.6,20.04 31.01,17.63 31.01,16.1 31.87,15.24 33.27,15.24 34.54,16.51 v49.78,16.51
  Bottom 0.254: TIA.36 49.78,34.16 48.8,33.18 48.8,16.51 v49.78,16.51
I5  (via drill 0.61)
  Top 0.254: R6.2 R5.1 v81.53,16.51
  Bottom 0.254: v81.53,16.51 80.26,17.78 68.83,17.78 64.71,13.66 53.59,13.66 52.32,14.93 52.32,18.27 53.31,19.26 53.31,21.38 52.32,22.37 TIA.35
LEFTFIRE
  Top 0.254: C2.1 R4.1 9.14,11.43 11.83,8.74 LEFT-JOY.6
LUM0
  Bottom 0.254: IC1.9 35.81,54.61 35.81,46.99 37.08,45.72 37.08,43.18 38.18,42.09 44.03,42.09 46.29,39.83 51.05,39.83 51.79,39.09 54,39.09 54.58,38.51 54.58,37.69 53.76,36.87 53.76,34.31 53.59,34.14 53.59,24.13 TIA.8
LUM1
  Bottom 0.254: IC1.5 29.18,47.98 29.18,39.65 31.18,37.66 40.45,37.66 41.88,39.09 43.84,39.09 44.83,38.1 49.29,38.1 50.77,36.62 50.77,34.5 49.78,33.51 TIA.5
LUM2
  Bottom 0.254: IC1.7 34.54,43.18 36.09,41.63 43.84,41.63 46.1,39.37 48.51,39.37 48.87,39.01 50.91,39.01 53.31,36.62 53.31,34.5 52.78,33.97 52.78,22.55 53.76,21.57 53.76,21.42 TIA.7
N$1
  Top 0.254: D1.C 18.51,46.99 18.89,46.61 20.19,46.61 IC1.2
N$2
  Top 0.254: C8.2 14.22,69.16 U$4.1
N$3
  Top 0.254: D1.A R7.2
N$4
  Top 0.254: R8.1 IC1.4
N$5
  Top 0.254: IC1.6 R9.2
N$6
  Top 0.254: R9.1 19.3,41.91 R8.2 14.22,44.45 12.95,45.72 R7.1 12.95,48.26 18.92,54.23 19.71,54.23 20.3,54.81 20.3,56.39 21.43,57.53 22.23,57.53 R10.1 | R11.1 R10.1 | R10.1 T1.2 25.02,62.23 R12.2
N$7
  Top 0.254: R10.2 IC1.10
N$8
  Top 0.254: R13.2 21.84,62.23 T1.1
N$9
  Bottom 0.254: T1.3 24.38,64.77 R14.1
N$10
  Top 0.254: C8.1 11.68,66.04 R14.2
N$12
  Top 0.254: R15.2 38.73,57.53 36.67,57.53 35.53,56.39 35.53,54.81 34.95,54.23 31.59,54.23 29.94,55.88 IC1.12
N$13
  Top 0.254: C9.1 18.67,69.22 U$4.4
N$14
  Top 0.254: C9.2 R18.2
N$15
  Top 0.254: R19.1 R20.2 9.14,88.9 9.14,78.74 11.68,76.2 14.22,76.2 14.86,75.56 U$4.8
N$16
  Top 0.254: R21.2 R22.1 11.68,88.9 11.68,80.01 12.95,78.74 16.76,78.74 17.4,78.11 U$4.6
N$17
  Top 0.254: R23.1 R24.2 6.6,88.9 6.6,78.74 12.95,72.39 18.03,72.39 18.67,73.02 U$4.5
N$18
  Top 0.254: R27.1 95.22,42.19 93.82,42.19 92.96,43.05 IC2.1 94.23,49.53 Q1.1
  Bottom 0.254: Q1.1 96.85,59.69 98.76,61.59 99.87,61.59 101.78,59.69 C12.1
N$19
  Top 0.254: IC2.2 95.5,44.45 C13.2 97.91,43.18 98.9,42.19 100.86,42.19 R27.2
N$20
  Top 0.254: IC2.3 98.04,44.45 C13.1 100.45,43.18 102.71,45.44 103.53,45.44 104.11,44.86 104.11,38.38 R28.1
N$21
  Top 0.254: R28.2 106.93,44.45 IC2.5 IC2.4 99.31,49.53 Q1.2
N$22
  Top 0.254: D2.A D3.C 30.73,87.63 C14.2
N$23
  Top 0.254: C15.1 29.46,74.93 R29.A 32,77.47 D3.A
OCL0
  Top 0.152: TIA.4 47.24,33.59 48.18,34.52 48.18,53 52.32,57.15 6507.27
OCL2
  Top 0.152: 6507.28 46.29,63.18 41.78,63.18 41.23,63.73 41.23,67.08 42.16,68.01 6532.39
  Bottom 0.254: 6507.28 50.88,58.59 50.88,43.2 51.73,42.35 52.32,42.35 52.97,42.35 53.89,41.44 55.13,41.44 56.05,40.53 56.07,40.53 56.13,40.53 70.22,40.53 TIA.26
OSC
  Top 0.254: TIA.11 66.22,19.12 66.22,19.11 67.96,17.37 73.66,17.37 75.32,15.71 75.32,14.77 75.99,14.11 83.1,14.11 86.9,10.31 87.95,10.31 88.69,11.05 88.69,12.11 92.69,16.1 92.69,16.92 91.69,17.91 91.69,29.21 94.23,31.75 107.06,31.75 109.19,33.88 109.19,44.86 108.61,45.44 108.48,45.44 IC2.6
  Bottom 0.254: TIA.11 58.67,26.67 58.67,36.34 57.81,37.2 57.04,37.2 55.96,38.28 55.96,39.08 54.57,40.46 52.36,40.46 51.62,41.2 48.6,41.2 47.88,41.92 47.88,42.7 44.68,45.9 43.9,45.9 42.34,47.46 42.34,55.08 30.46,66.97 30.46,71.53 28.65,73.33 28.65,76.39 28.19,76.85 28.19,85.09 C14.1
PA0
  Top 0.254: RIGHT-JOY.1 83.76,15.24 C17.1
  Bottom 0.254: 6532.8 60.93,62.52 60.93,58.63 59.94,57.64 59.94,48.26 62.12,46.09 83.21,46.09 83.79,45.51 83.79,15.53 87.42,11.89 RIGHT-JOY.1
PA1
  Bottom 0.254: 6532.9 61.38,64.6 61.38,48.09 62.93,46.55 83.4,46.55 84.24,45.7 84.24,15.71 85.99,13.97 87.88,13.97 90.19,11.66 RIGHT-JOY.2
PA2
  Bottom 0.254: 6532.10 62.48,61.74 63.47,60.75 63.47,58.63 62.48,57.64 62.48,47.64 63.12,47 83.59,47 86.33,44.27 86.33,15.53 87.43,14.43 89.97,14.43 92.81,11.58 RIGHT-JOY.3
PA3
  Bottom 0.254: 6532.11 65.02,61.74 63.92,60.64 63.92,48.09 64.55,47.46 81.53,47.46 81.72,47.46 83.78,47.46 86.78,44.45 86.78,15.71 87.62,14.88 91.46,14.88 94.76,11.58 RIGHT-JOY.4
PA4
  Bottom 0.254: 6532.12 67.56,64.77 66.01,63.21 66.01,58.63 65.02,57.64 65.02,48.26 65.37,47.92 83.97,47.92 89.15,42.73 89.15,22.86 99.16,12.85 99.58,12.85 99.77,12.66 99.77,10.5 99.31,10.04 99.31,7.62 96.77,5.08 14.22,5.08 10.41,8.89 10.41,10.16 11.83,11.58 LEFT-JOY.1
PA5
  Bottom 0.254: 6532.13 66.47,62.4 66.47,49.47 67.56,48.37 84.16,48.37 89.61,42.92 89.61,23.29 99.6,13.31 99.77,13.31 100.23,12.85 100.23,7.89 96.96,4.62 14.04,4.62 9.96,8.7 9.96,10.84 11.97,12.85 13.99,12.85 LEFT-JOY.2
PA6
  Bottom 0.254: 6532.14 68.55,61.94 68.55,49.82 69.53,48.83 84.35,48.83 90.07,43.11 90.07,23.72 100.69,13.1 100.69,7.7 97.15,4.17 13.85,4.17 9.5,8.51 9.5,11.03 11.78,13.31 15.33,13.31 17.06,11.58 LEFT-JOY.3
PA7
  Bottom 0.254: 6532.15 70.47,61.33 69.7,61.33 69,60.64 69,50.8 70.52,49.29 84.54,49.29 90.53,43.3 90.53,24.03 101.15,13.41 101.15,7.51 97.34,3.71 13.66,3.71 9.04,8.32 9.04,11.22 11.59,13.76 17.65,13.76 19.83,11.58 LEFT-JOY.4
PB0  (via drill 0.61)
  Top 0.254: START.3 43.43,6.63 START.4 44.7,6.63 47.52,3.81 v99.31,3.81
  Bottom 0.254: 6532.24 80.26,68.09 81.25,67.1 81.25,64.98 80.67,64.4 79.9,64.4 76.17,60.67 76.17,58.63 73.91,56.37 73.91,52.07 75.18,50.8 84.97,50.8 91.9,43.87 91.9,26.47 97.05,21.31 97.18,21.31 98.04,20.45 98.04,17.8 102.06,13.79 102.06,7.13 99.31,4.39 v99.31,3.81
PB1  (via drill 0.61)
  Top 0.254: SELECT.3 72.64,6.63 SELECT.4 73.63,6.63 75.18,5.08 v101.85,5.08
  Bottom 0.254: 6532.23 82.8,68.09 81.7,66.99 81.7,64.79 80.86,63.95 80.71,63.95 78.71,61.94 78.71,58.63 76.45,56.37 76.45,52.07 77.27,51.26 85.16,51.26 92.35,44.06 92.35,28.55 99.59,21.31 99.72,21.31 100.3,20.73 100.3,19.91 99.65,19.25 99.65,16.84 102.52,13.98 102.52,6.94 101.85,6.28 v101.85,5.08
PB3
  Bottom 0.254: 6532.21 99.31,81.28 100.58,82.55 S1.2
PB6
  Bottom 0.254: 6532.17 77.72,63.5 76.45,63.5 73.63,60.67 73.63,58.63 72.64,57.64 72.64,50.8 73.24,50.2 84.92,50.2 91.44,43.68 91.44,25.68 93.74,23.37 93.74,23.35 95.5,21.59 95.5,19.7 101.6,13.6 101.6,7.32 97.53,3.25 13.47,3.25 8.4,8.31 8.4,11.35 7.87,11.88 7.87,25.4 S2.2
PB7  (via drill 0.61)
  Top 0.254: v94.23,21.59 96.77,24.13 100.58,24.13 101.85,25.4 S3.2
  Bottom 0.254: 6532.16 76.09,64.4 74.82,64.4 71.09,60.67 71.09,58.63 70.1,57.64 70.1,50.8 71.16,49.75 84.73,49.75 90.98,43.49 90.98,24.22 93.61,21.59 v94.23,21.59
R/W
  Top 0.152: 6532.35 52.32,68.01 51.39,67.08 51.39,65 51.94,64.45 52.64,64.45 54.86,62.23 54.86,59.92 | 54.86,59.92 6507.26 | TIA.25 77.72,30.48 83.11,25.09 86.15,25.09 89.17,22.07 89.17,19.13 88.06,18.02 85.58,18.02 85.34,17.78 68.13,17.78 66.63,19.28 66.63,21.82 53.93,34.52 53.93,36.6 56.13,38.8 56.13,58.65 54.86,59.92
RDY
  Top 0.152: TIA.3 44.7,19.62 46.86,17.46 61.6,17.46 63.19,19.05 63.75,19.05 63.75,24.19 53.57,34.37 53.57,36.75 54.86,38.04 6507.3
  Top 0.254: R1.1 53.59,43.18 6507.3
RESET
  Top 0.152: 6532.34 54.86,97.29 57.11,99.53 57.11,100.41 56.54,100.98 53.19,100.98 52.62,100.41 52.62,99.35 50.04,96.77 50.04,83 50.72,82.32 50.72,80.24 50.04,79.56 50.04,68.27 48.85,67.08 48.85,62.6 51.39,62.6 52.04,61.95 | 52.04,61.95 53.26,60.73 53.26,56.05 49.78,52.58 6507.1 | C1.1 45.97,43.18 R2.2 45.97,53.34 51.05,58.42 51.05,60.96 52.04,61.95
RIGHTFIRE
  Top 0.254: C3.1 R6.1 101.85,13.97 99.77,11.89 99.77,10.5 99.58,10.31 91.36,10.31 89.79,8.74 RIGHT-JOY.6
SYNC
  Bottom 0.254: TIA.2 42.16,33.02 43.43,34.29 43.43,36.34 42.57,37.2 27.83,37.2 24.38,40.64 IC1.3
VCC  (via drill 0.61)
  Top 0.254: R25.2 R26.2 38.35,38.1 R1.2 | v16.76,67.31 16.13,67.95 U$4.2 | v15.49,77.47 16.13,76.83 U$4.7 | v92.96,7.11 87.12,7.11 86.61,7.62 v85.34,7.62 | v70.1,15.75 66.6,12.24 65.64,12.24 62.14,8.74 33.17,8.74 31.72,7.29 26.92,7.29 | LEFT-JOY.7 17.62,8.74 18.89,10.01 19.94,10.01 20.91,9.04 20.91,8.21 21.84,7.29 26.92,7.29 | v29.46,16.51 29.46,13.15 27.66,11.35 27.66,8.03 26.92,7.29 | v58.17,46.99 58.17,40.13 v57.4,39.37 | v87.88,29.21 v81.53,29.21
  Bottom 0.254: v87.88,29.21 87.24,29.21
  pour Bottom: -1.02,-3.81 -1.02,113.03 -6.1,118.11 118.36,118.11 118.36,-5.08 117.09,-6.35 1.52,-6.35